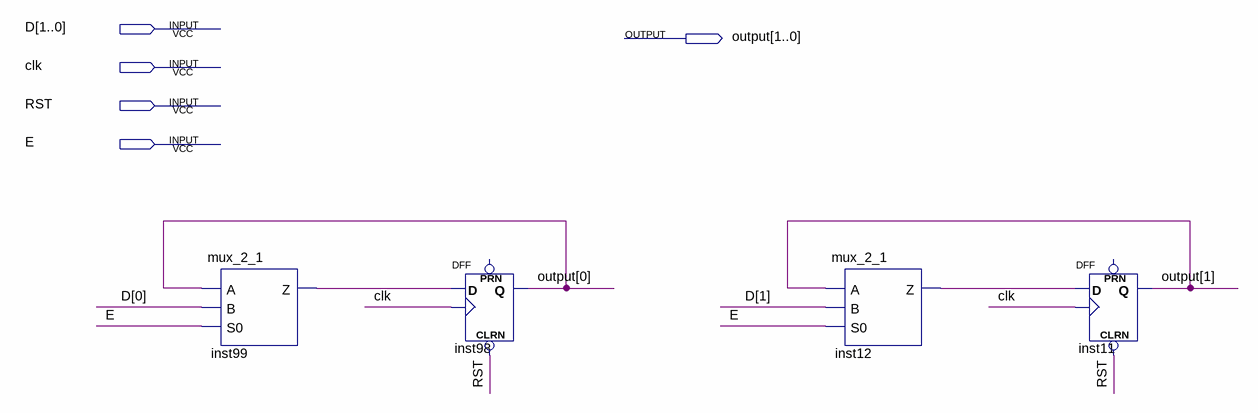
[diagram p0: schematic sheet]
// Quartus schematic REG_2b.bdf as structural Verilog: 4 symbols, 5 pins
module REG_2b (
  input  [1:0] D,
  input  clk,
  input  RST,
  input  E,
  output [1:0] \output 
);

  wire inst12_z, inst99_z;

  mux_2_1 inst99 (.A(\output [0]), .B(D[0]), .S0(E), .Z(inst99_z));
  DFF inst98 (.CLRN(RST), .CLK(clk), .D(inst99_z), .Q(\output [0]));  // open: PRN
  mux_2_1 inst12 (.A(\output [1]), .B(D[1]), .S0(E), .Z(inst12_z));
  DFF inst11 (.CLRN(RST), .CLK(clk), .D(inst12_z), .Q(\output [1]));  // open: PRN
endmodule
